# EAGLE schematic SoftstartPlugIn (EAGLE 7.5.0)
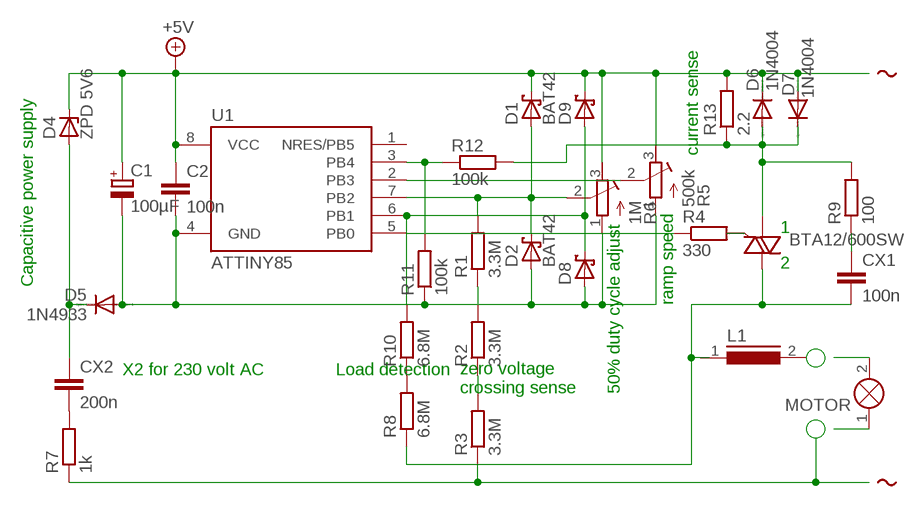
[diagram p0: schematic, sheet 1]

## Parts
BTA12/600SW  BT138-H  [TO220BH]
C1  100µF  CPOL-EUE7.5-16  [E7,5-16]
C2  100n  C-EU025-025X050  [C025-025X050]
CX1  100n  CXXC15B5  [XC15B5]
CX2  200n  CXXC15B5  [XC15B5]
D1  BAT42  [DO35-10]
D2  BAT42  [DO35-10]
D4  ZPD 5V6  ZPD  [DO35Z10]
D5  1N4933  [DO41-10]
D6  1N4004  [DO41-10]
D7  1N4004  [DO41-10]
D8  BAT42  [DO35-10]
D9  BAT42  [DO35-10]
L1  82114A  [82114A]
MOTOR  SIGNALLAMPE  [LAMPE]
R1  3.3M  R-EU_0207/10  [0207/10]
R2  3.3M  R-EU_0207/10  [0207/10]
R3  3.3M  R-EU_0207/10  [0207/10]
R4  330  R-EU_0207/10  [0207/10]
R5  500k  R-TRIMM4G/J  [RTRIM4G/J]
R6  1M  R-TRIMM4G/J  [RTRIM4G/J]
R7  1k  R-EU_0207/10  [0207/10]
R8  6.8M  R-EU_0207/10  [0207/10]
R9  100  R-EU_0207/10  [0207/10]
R10  6.8M  R-EU_0207/10  [0207/10]
R11  100k  R-EU_0207/10  [0207/10]
R12  100k  R-EU_0207/10  [0207/10]
R13  2.2  R-EU_0207/10  [0207/10]
U1  ATTINY85  ATTINY85V-10P  [PDIP08_300MIL]

## Nets
+5V: C1.+ C2.1 D1.C D4.C D6.C D7.A D9.C R5.3(E) R6.3(E) R13.2 U1.8(VCC)
N$1: R1.1 R2.2
N$2: R2.1 R3.2
N$3: D1.A R1.2 R6.2(S) U1.7(PB2)
N$4: R11.2 R12.1 U1.3(PB4)
N$5: D2.C
N$6: CX2.1 D4.A D5.C
N$7: CX2.2 R7.2
N$8: R3.1 R7.1
N$9: BTA12/600SW.G R4.2
N$10: R4.1 U1.5(PB0)
N$11: BTA12/600SW.T1(A1) D6.A D7.C R9.2 R12.2 R13.1
N$13: CX1.1 R9.1
N$14: R5.2(S) U1.2(PB3)
N$15: MOTOR.2(X2)
N$16: R8.2 R10.1
N$17: C1.- C2.2 D2.A D5.A D8.A D8.C D9.A R5.1(A) R6.1(A) R10.2 R11.1 U1.4(GND) U1.6(PB1)
N$18: MOTOR.1(X1)
N$19: BTA12/600SW.T2(A2) CX1.2 R8.1
Unconnected: L1.1 L1.2 U1.1(NRES/PB5)

## Notes on the sheet
- current sense
- 1
- 2
- Capacitive power supply
- ramp speed
- X2 for 230 volt AC | Load detection
- zero voltage
  crossing sense
- 50% duty cycle adjust

## Library data of the parts
BTA12/600SW = triac:BT138: TRIAC Source: http://www.semiconductors.philips.com BT138_SERIES_2.pdf
C1 = rcl:CPOL-EU: POLARIZED CAPACITOR, European symbol
C2 = rcl:C-EU: CAPACITOR, European symbol
CX1 CX2 = rcl:CX: X CAPACITOR for power line
D1 D2 D8 D9 = diode:BAT42: DIODE barrier diode
D4 = diode:ZPD: Z DIODE 500 mW
D5 = diode:1N4933: DIODE fast recovery rectifier, 1A
D6 D7 = diode:1N4004: DIODE general purpose rectifier, 1 A
L1 = inductors:82114A: INDUCTOR
MOTOR = e-lampen-signalisation:SIGNALLAMPE: Lampe
R1-R4 R7-R13 = rcl:R-EU_: RESISTOR, European symbol
R5 R6 = rcl:R-TRIMM: Trimm resistor
U1 = attiny25_45_85:ATTINY85*: ATMEL ATtiny 85 Packages: P = PDIP 08 30mil S = SOIC 08 EIAJ 208mil Technologies Note: for complete ordering code (temp. range, finish, tape&reel etc.) see www.atmel.com • Supply Voltage: V = (1.8…5.5)V | [blank] = (2.7…5.5)V • Speed: 10 = 10 MHz | 20 = 20 MHz Author: Dipl.-Ing. FH Rainer Bayer HHN Hochschule Heilbronn (Heilbronn University), rainer.bayer@hs-heilbronn.de Ingenieurbüro ing-rb, mail@ing-rb.de